# Altium schematic sheet Schaltbox-Renault_iso.SchDoc: Schaltbox für PC I/O Power
size A3; Organization: Schleißheimer GmbH; Address2: Am Kalkofen 10; Address3: D-61206 Wöllstadt; Address4: Deutschland; Revision: 1.0; SheetNumber: 1; SheetTotal: 3; PageSetup: Record=PageOptions|CenterHorizontal=True|CenterVertical=True|PrintScale=0.70|XCorrection=1.00|YCorrection=1.00|PrintKind=0|BorderSize=5000000|LeftOffset=0|BottomOffset=0|Orientation=2|PaperLength=1000|PaperWidth=1000|Scale=100|PaperSource=7|PrintQuality=-4|MediaType=1|DitherType=10|PrintScaleMode=1|PaperKind=A4|PaperIndex=9; DocumentName: Schaltbox.SchDoc
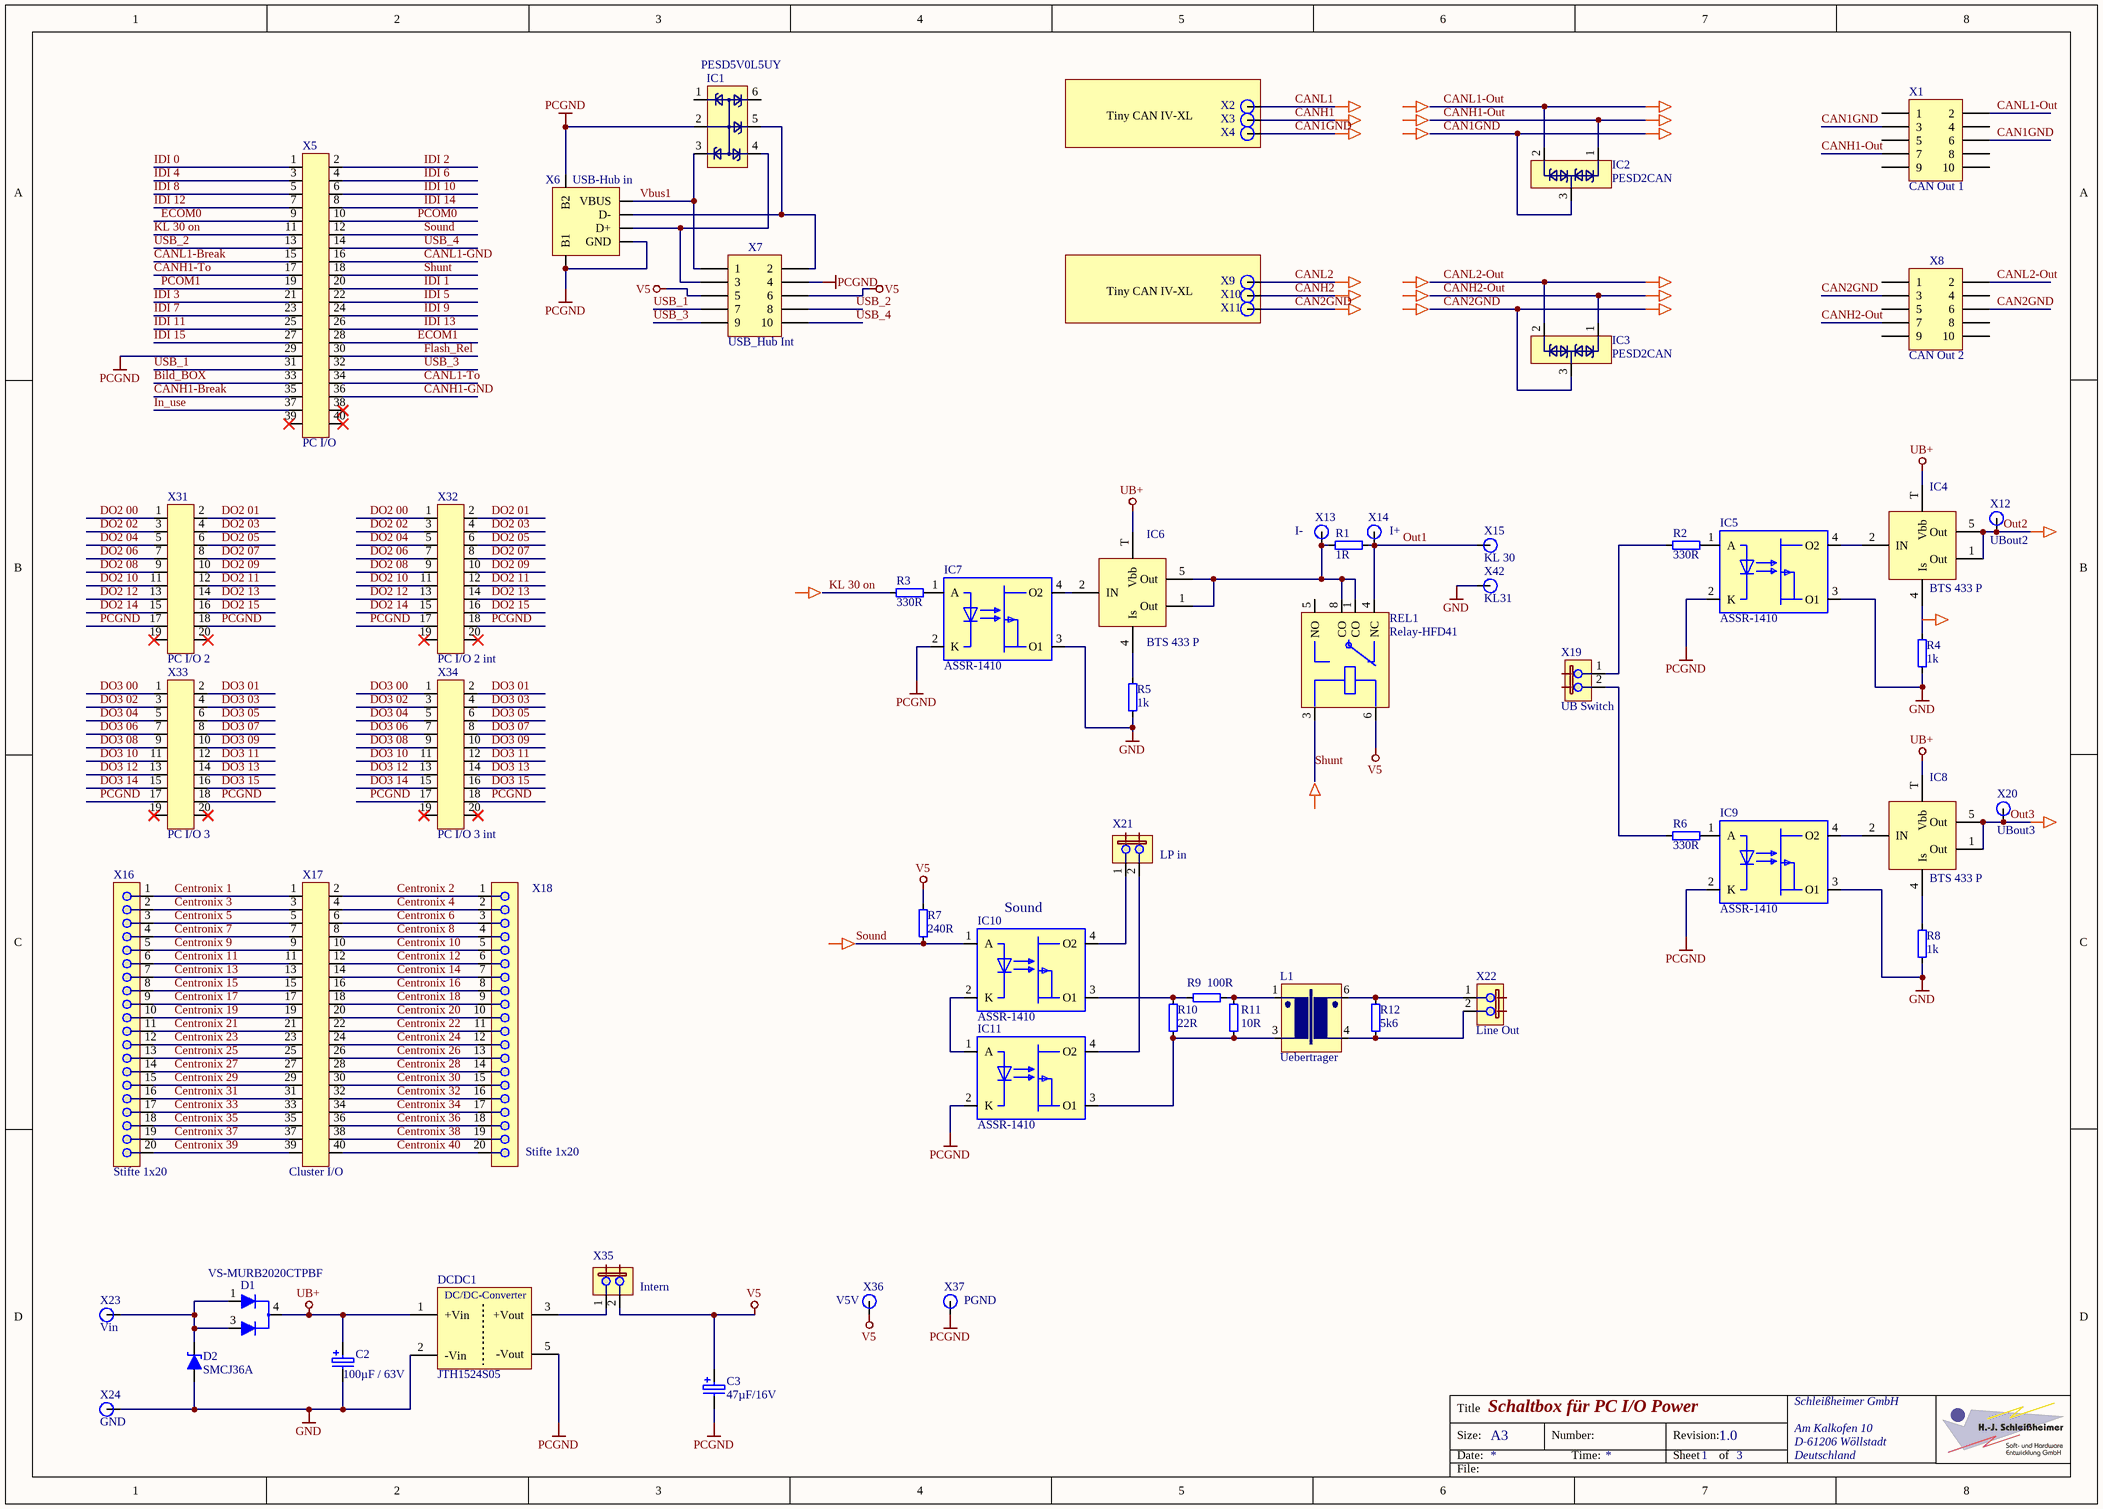
[diagram p0: Schaltbox-Renault_iso.SchDoc]

## Parts
(Parts that share a designator on the sheet are numbered #1, #2 ... from top to bottom, then left to right.)
*#1  Pfeil-->  (value not drawn)  (graphical)
*#2  Pfeil-->  (value not drawn)  (graphical)
*#3  Pfeil-->  (value not drawn)  (graphical)
*#4  Pfeil-->  (value not drawn)  (graphical)
*#5  Pfeil-->  (value not drawn)  (graphical)
*#6  Pfeil-->  (value not drawn)  (graphical)
*#7  Pfeil-->  (value not drawn)  (graphical)
*#8  Pfeil-->  (value not drawn)  (graphical)
*#9  Pfeil-->  (value not drawn)  (graphical)
*#10  Pfeil-->  (value not drawn)  (graphical)
*#11  Pfeil-->  (value not drawn)  (graphical)
*#12  Pfeil-->  (value not drawn)  (graphical)
*#13  Pfeil-->  (value not drawn)  (graphical)
*#14  Pfeil-->  (value not drawn)  (graphical)
*#15  Pfeil-->  (value not drawn)  (graphical)
*#16  Pfeil-->  (value not drawn)  (graphical)
*#17  Pfeil-->  (value not drawn)  (graphical)
*#18  Pfeil-->  (value not drawn)  (graphical)
*#19  Pfeil-->  (value not drawn)  (graphical)
*#20  Pfeil-->  (value not drawn)  (graphical)
*#21  Pfeil-->  (value not drawn)  (graphical)
*#22  Pfeil-->  (value not drawn)  (graphical)
*#23  Pfeil-->  (value not drawn)  (graphical)
*#24  Pfeil-->  (value not drawn)  (graphical)
C2  100µF / 63V  [ALU-G]
C3  47µF/16V  [ALU-D]
D1  VS-MURB2020CTPBF  [TO252-3_LD_(DPAK)]
D2  SMCJ36A  [SMC_MD_(DO214AB)]
DCDC1  JTH1524S05  [JTH15]
IC1  PESD5V0L5UY  [SOT363_MD_(SC88 / SC70-6)]
IC2  PESD2CAN  [SOT23_MD]
IC3  PESD2CAN  [SOT23_MD]
IC4  BTS 433 P  [TO252-5_MD_(DPAK)]
IC5  ASSR-1410  [SO-4]
IC6  BTS 433 P  [TO252-5_MD_(DPAK)]
IC7  ASSR-1410  [SO-4]
IC8  BTS 433 P  [TO252-5_MD_(DPAK)]
IC9  ASSR-1410  [SO-4]
IC10  ASSR-1410  [SO-4]
IC11  ASSR-1410  [SO-4]
L1  Uebertrager  [SM-LP]
R1  1R  [R2512HD]
R2  330R  [R0603MD]
R3  330R  [R0603HD]
R4  1k  [R0603HD]
R5  1k  [R0603HD]
R6  330R  [R0603MD]
R7  240R  [R0603MD]
R8  1k  [R0603HD]
R9  100R  [R0603MD]
R10  22R  [R0805MD]
R11  10R  [R0603MD]
R12  5k6  [R0603MD]
REL1  Relay-HFD41  [REL_HFD41]
X1  CAN Out 1  [HDR2X5]
X2  Anschlusspin  [Loetpad_Oval_0.8]  (value not drawn)
X3  Anschlusspin  [Loetpad_Oval_0.8]  (value not drawn)
X4  Anschlusspin  [Loetpad_Oval_0.8]  (value not drawn)
X5  PC I/O  [SchneidKlemm_40]
X6  USB-Hub in  [USB_TypB]
X7  USB_Hub Int  [HDR2X5]
X8  CAN Out 2  [HDR2X5]
X9  Anschlusspin  [Loetpad_Oval_0.8]  (value not drawn)
X10  Anschlusspin  [Loetpad_Oval_0.8]  (value not drawn)
X11  Anschlusspin  [Loetpad_Oval_0.8]  (value not drawn)
X12  UBout2  [Loetoese-3.2]
X13  I-  [Loetpad_Oval_0.8]
X14  I+  [Loetpad_Oval_0.8]
X15  KL 30  [Loetoese-3.2]
X16  Stifte 1x20  [Stifte_1x20]
X17  Cluster I/O  [SchneidKlemm_40]
X18  Stifte 1x20  [Stifte_1x20]
X19  UB Switch  [Stifte_1x2]
X20  UBout3  [Loetoese-3.2]
X21  LP in  [Stifte_1x2]
X22  Line Out  [Stifte_1x2]
X23  Vin  [Loetoese-3.2]
X24  GND  [Loetoese-3.2]
X31  PC I/O 2  [SchneidKlemm_20]
X32  PC I/O 2 int  [SchneidKlemm_20]
X33  PC I/O 3  [SchneidKlemm_20]
X34  PC I/O 3 int  [SchneidKlemm_20]
X35  Intern  [Stifte_1x2]
X36  V5V  [Loetpad_Oval_0.8]
X37  PGND  [Loetpad_Oval_0.8]
X42  KL31  [Loetoese-3.2]

## Nets
GND: C2.N D2.2 DCDC1.2(-Vin) IC5.3(O1) IC7.3(O1) IC9.3(O1) R4.1 R5.1 R8.1 X24.1 X42.1
PCGND: C3.N DCDC1.5(-Vout) IC1.2 IC5.2(K) IC7.2(K) IC9.2(K) IC11.2(K) X5.29 X6.B1 X6.B2 X6.GND X7.4 X31.17 X31.18 X32.17 X32.18 X33.17 X33.18 X34.17 X34.18 X37.1
UB+: C2.P D1.4(K) DCDC1.1(+Vin) IC4.T(Vbb) IC6.T(Vbb) IC8.T(Vbb)
V5: C3.P R7.2 REL1.6 X7.5 X7.6 X35.2 X36.1
Bild_BOX: X5.33
CAN1GND: IC2.3 X1.3 X1.6 X4.1
CAN2GND: IC3.3 X8.3 X8.6 X11.1
CANH1: X3.1
CANH1-Break: X5.35
CANH1-GND: X5.36
CANH1-Out: IC2.1 X1.7
CANH1-To: X5.17
CANH2: X10.1
CANH2-Out: IC3.1 X8.7
CANL1: X2.1
CANL1-Break: X5.15
CANL1-GND: X5.16
CANL1-Out: IC2.2 X1.2
CANL1-To: X5.34
CANL2: X9.1
CANL2-Out: IC3.2 X8.2
Centronix 1: X16.1 X17.1
Centronix 2: X17.2 X18.1
Centronix 3: X16.2 X17.3
Centronix 4: X17.4 X18.2
Centronix 5: X16.3 X17.5
Centronix 6: X17.6 X18.3
Centronix 7: X16.4 X17.7
Centronix 8: X17.8 X18.4
Centronix 9: X16.5 X17.9
Centronix 10: X17.10 X18.5
Centronix 11: X16.6 X17.11
Centronix 12: X17.12 X18.6
Centronix 13: X16.7 X17.13
Centronix 14: X17.14 X18.7
Centronix 15: X16.8 X17.15
Centronix 16: X17.16 X18.8
Centronix 17: X16.9 X17.17
Centronix 18: X17.18 X18.9
Centronix 19: X16.10 X17.19
Centronix 20: X17.20 X18.10
Centronix 21: X16.11 X17.21
Centronix 22: X17.22 X18.11
Centronix 23: X16.12 X17.23
Centronix 24: X17.24 X18.12
Centronix 25: X16.13 X17.25
Centronix 26: X17.26 X18.13
Centronix 27: X16.14 X17.27
Centronix 28: X17.28 X18.14
Centronix 29: X16.15 X17.29
Centronix 30: X17.30 X18.15
Centronix 31: X16.16 X17.31
Centronix 32: X17.32 X18.16
Centronix 33: X16.17 X17.33
Centronix 34: X17.34 X18.17
Centronix 35: X16.18 X17.35
Centronix 36: X17.36 X18.18
Centronix 37: X16.19 X17.37
Centronix 38: X17.38 X18.19
Centronix 39: X16.20 X17.39
Centronix 40: X17.40 X18.20
DO2 00: X31.1 X32.1
DO2 01: X31.2 X32.2
DO2 02: X31.3 X32.3
DO2 03: X31.4 X32.4
DO2 04: X31.5 X32.5
DO2 05: X31.6 X32.6
DO2 06: X31.7 X32.7
DO2 07: X31.8 X32.8
DO2 08: X31.9 X32.9
DO2 09: X31.10 X32.10
DO2 10: X31.11 X32.11
DO2 11: X31.12 X32.12
DO2 12: X31.13 X32.13
DO2 13: X31.14 X32.14
DO2 14: X31.15 X32.15
DO2 15: X31.16 X32.16
DO3 00: X33.1 X34.1
DO3 01: X33.2 X34.2
DO3 02: X33.3 X34.3
DO3 03: X33.4 X34.4
DO3 04: X33.5 X34.5
DO3 05: X33.6 X34.6
DO3 06: X33.7 X34.7
DO3 07: X33.8 X34.8
DO3 08: X33.9 X34.9
DO3 09: X33.10 X34.10
DO3 10: X33.11 X34.11
DO3 11: X33.12 X34.12
DO3 12: X33.13 X34.13
DO3 13: X33.14 X34.14
DO3 14: X33.15 X34.15
DO3 15: X33.16 X34.16
ECOM0: X5.9
ECOM1: X5.28
Flash_Rel: X5.30
IDI 0: X5.1
IDI 1: X5.20
IDI 2: X5.2
IDI 3: X5.21
IDI 4: X5.3
IDI 5: X5.22
IDI 6: X5.4
IDI 7: X5.23
IDI 8: X5.5
IDI 9: X5.24
IDI 10: X5.6
IDI 11: X5.25
IDI 12: X5.7
IDI 13: X5.26
IDI 14: X5.8
IDI 15: X5.27
In_use: X5.37
KL 30 on: R3.2 X5.11
Out1: R1.1 REL1.4(NC) X14.1 X15.1
Out2: IC4.1(Out) IC4.5(Out) X12.1
Out3: IC8.1(Out) IC8.5(Out) X20.1
PCOM0: X5.10
PCOM1: X5.19
Shunt: REL1.3 X5.18
Sound: IC10.1(A) R7.1 X5.12
USB_1: X5.31 X7.7
USB_2: X5.13 X7.8
USB_3: X5.32 X7.9
USB_4: X5.14 X7.10
Vbus1: IC1.3 X6.VBUS X7.1
NetD1_1: D1.1(A1) D1.3(A2) D2.1 X23.1
NetDCDC1_3: DCDC1.3(+Vout) X35.1
NetIC1_4: IC1.4 X6.D+ X7.3
NetIC1_5: IC1.5 X6.D- X7.2
NetIC4_2: IC4.2(IN) IC5.4(O2)
NetIC4_4: IC4.4(Is) R4.2
NetIC5_1: IC5.1(A) R2.1
NetIC6_1: IC6.1(Out) IC6.5(Out) R1.2 REL1.1(CO) REL1.8(CO) X13.1
NetIC6_2: IC6.2(IN) IC7.4(O2)
NetIC6_4: IC6.4(Is) R5.2
NetIC7_1: IC7.1(A) R3.1
NetIC8_2: IC8.2(IN) IC9.4(O2)
NetIC8_4: IC8.4(Is) R8.2
NetIC9_1: IC9.1(A) R6.1
NetIC10_2: IC10.2(K) IC11.1(A)
NetIC10_3: IC10.3(O1) R9.2 R10.2
NetIC10_4: IC10.4(O2) X21.1
NetIC11_3: IC11.3(O1) L1.3 R10.1 R11.1
NetIC11_4: IC11.4(O2) X21.2
NetL1_1: L1.1 R9.1 R11.2
NetL1_4: L1.4 R12.1 X22.2
NetL1_6: L1.6 R12.2 X22.1
NetR2_2: R2.2 X19.1
NetR6_2: R6.2 X19.2

Not connected (* = marked no-connect by the designer): IC1 1 6; REL1 5(NO); X1 1 4 5 8 9 10; X5 38* 39* 40*; X8 1 4 5 8 9 10; X31 19* 20*; X32 19* 20*; X33 19* 20*; X34 19* 20*

## Notes on the sheet
- Tiny CAN IV-XL
- (near IC10) Sound
- Title
- Size:
- Date:
- A3
- Number:
- Time:
- Revision:
- Sheet
- of
- File:
- (in symbol DC/DC-JTH15) DC/DC-Converter

## Library data of the parts
*#1-*#24 = Pfeil-->: No Footprint
C2 C3 = Cap Pol: Capacitor Polarized; Published: 8-Jun-2000; LatestRevisionDate: 17-Jul-2002; LatestRevisionNote: Re-released for DXP Platform.; PackageReference: C0805; Publisher: Altium Limited
  C2: Value: 100µF / 63V
  C3: Value: 47µF/16V
D1 = MURD620CT: Schottky Barrier Double Diode; Published: 17-Sep-2003; LatestRevisionDate: 12-Dec-2006; LatestRevisionNote: IPC-7351 Footprint Added.; DatasheetVersion: 4-Mar-2002; PackageVersion: May-1999; PackageReference: SOT23; Publisher: Altium Limited; PackageDescription: 3-Pin SOT-23 Package 0.95 mm Pitch, 2.3 mm Lead Span; ComponentLink1Description: Manufacturer Link; ComponentLink1URL: http://www.semiconductors.philips.com/; ComponentLink2Description: Datasheet; ComponentLink2URL: http://www.semiconductors.philips.com/acrobat/datasheets/BAT54_SERIES_4.pdf
D2 = SMCJ36A: Suppressor Diode, unidirektional, 36V, 1500 W, fFotprint SMC
DCDC1 = DC/DC-JTH15: 15W-Wandler Single; TYPE: JTH1524S05
IC1 = PESD5V0L5UY: ESD_Protection 5 Lines
IC2 IC3 = PESD2CAN: ESD-Protection CAN-Bus
IC4 IC6 IC8 = BTS443 P
IC5 IC7 IC9-IC11 = ASSR-1410: Solid State Relay, (Photo MOSFET)
L1 = Uebertrager: SM-LP-5001 Series -Surface Mount Line Matching Transformers
R1-R12 = Res: Resistor
  R2 R3 R6: VALUE: 330R
  R4 R5 R8: VALUE: 1k
REL1 = Relay-HFD41: Relay Hongfa Typ HFD41, SPDT, 2A/ 250VAC/30VDC
X1 X7 X8 = Header 5X2: Header, 5-Pin, Dual row; LatestRevisionDate: 17-Jul-2002; LatestRevisionNote: Re-released for DXP Platform.; Publisher: Altium Limited
X2-X4 X9-X15 X20 X23 X24 X36 X37 X42 = Anschlusspin: Anschluss, Bohrung 1.2mm
X5 X17 = CON-40pol: Schneid-Klemm-Verbinder 40pol
X6 = USB-Typ AB: USB-Stecker-Typ A und B,THT
X16 X18 = Stifte 1x20: Stiftleiste, Buchsenleiste
X19 X21 X22 X35 = Jumper-2: 2pol Jumper RM 2.54
X31-X34 = CON-2x10: Stift-, Buchs2x10, SchneidKlemm 20pol.